# Altium schematic sheet block diagram.schdoc
size A4
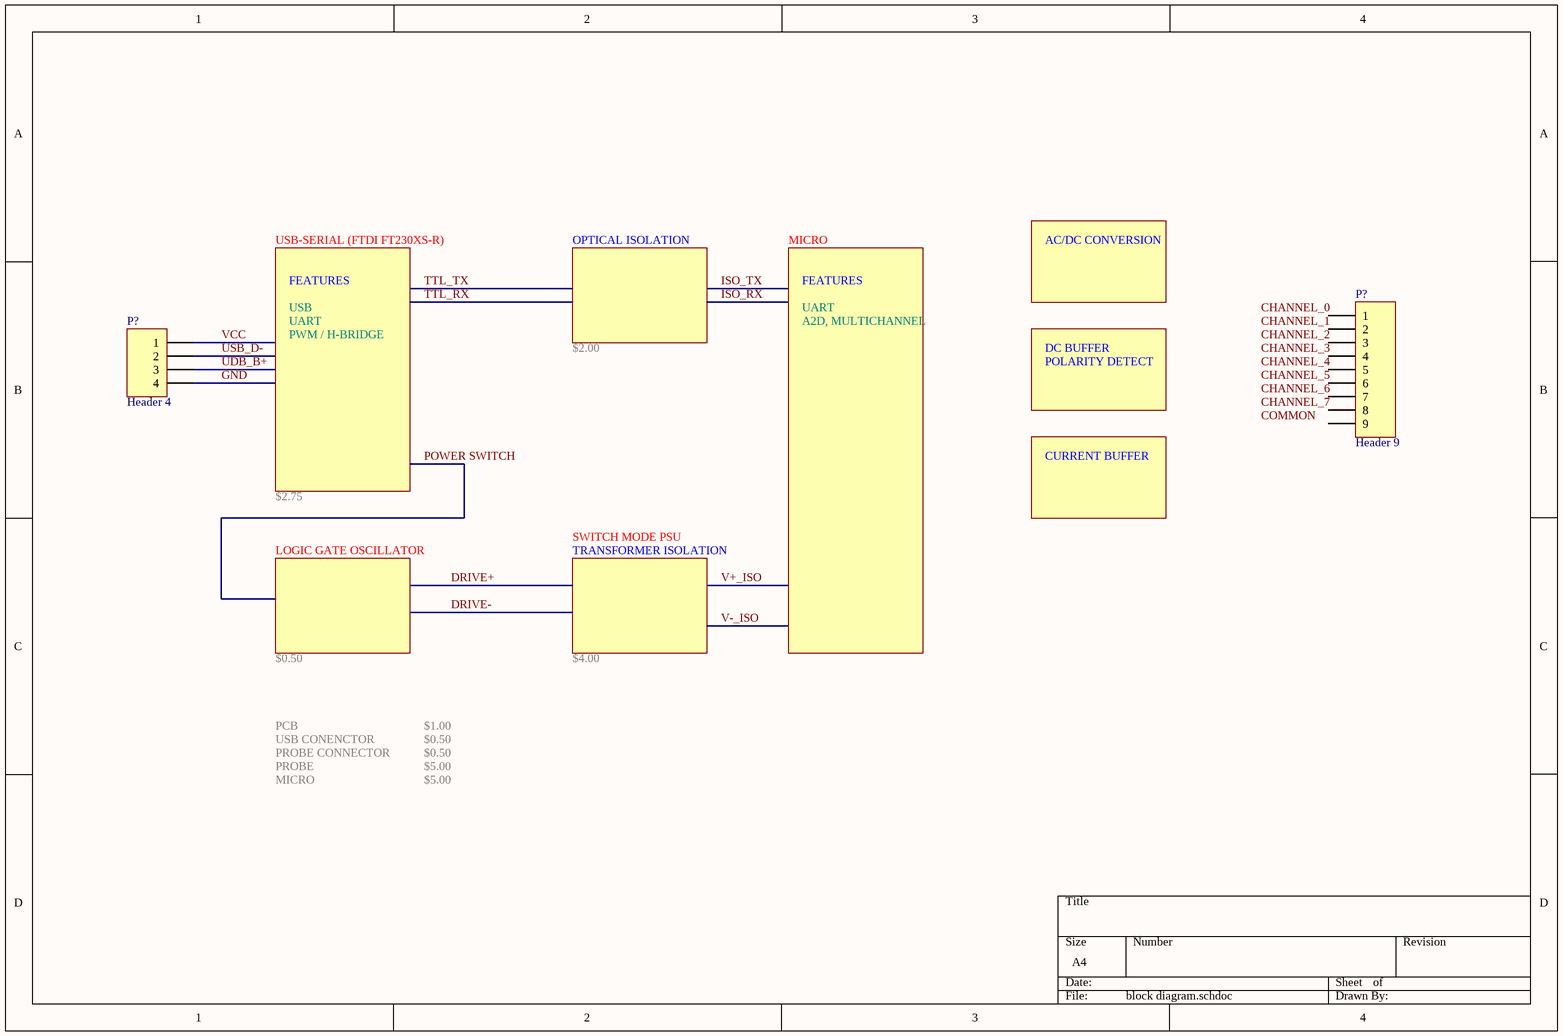
[diagram p0: block diagram.schdoc]

## Parts
(Parts that share a designator on the sheet are numbered #1, #2 ... from top to bottom, then left to right.)
P?#1  Header 9  [HDR1X9]
P?#2  Header 4  [HDR1X4]

## Nets
GND: P?#2.4
UDB_B+: P?#2.3
USB_D-: P?#2.2
VCC: P?#2.1

Not connected (* = marked no-connect by the designer): P?#1 1 2 3 4 5 6 7 8 9

## Notes on the sheet
- USB-SERIAL (FTDI FT230XS-R)
- OPTICAL ISOLATION
- MICRO
- AC/DC CONVERSION
- USB
- FEATURES
- UART
- PWM / H-BRIDGE
- $2.00
- A2D, MULTICHANNEL
- DC BUFFER
- POLARITY DETECT
- $2.75
- CURRENT BUFFER
- LOGIC GATE OSCILLATOR
- SWITCH MODE PSU
- TRANSFORMER ISOLATION
- $0.50
- $4.00
- PCB
- USB CONENCTOR
- PROBE CONNECTOR
- PROBE
- $1.00
- $5.00
- Labels drawn without touching a wire or pin: CHANNEL_0, CHANNEL_1, CHANNEL_2, CHANNEL_3, CHANNEL_4, CHANNEL_5, CHANNEL_6, CHANNEL_7, COMMON

## Library data of the parts
P?#1 = Header 9: Header, 9-Pin
P?#2 = Header 4: Header, 4-Pin